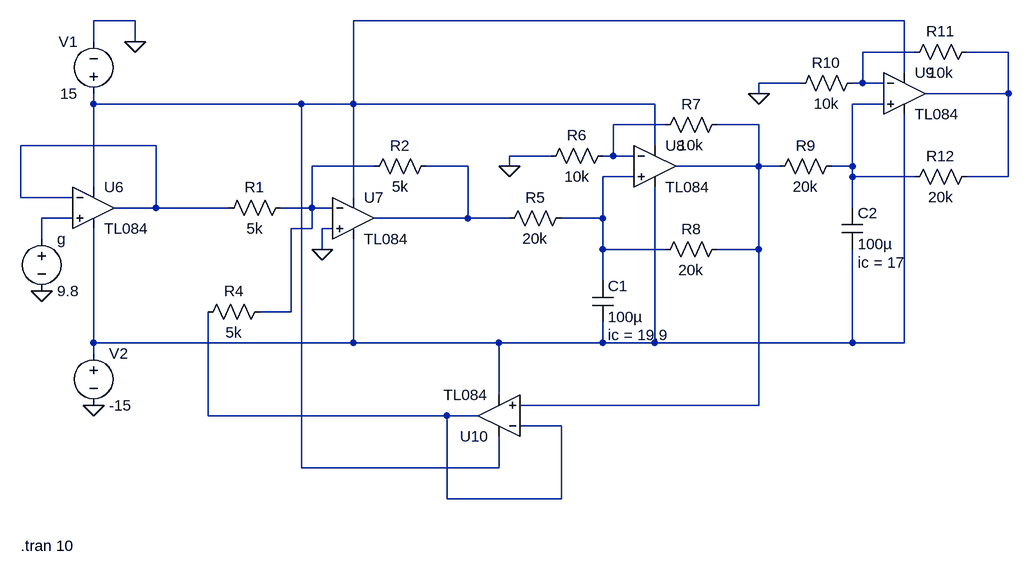
[diagram p0: schematic 2.asc]
2.asc, the LTspice schematic file:
Version 4
SHEET 1 1652 792
WIRE 112 -144 48 -144
WIRE 1296 -144 448 -144
WIRE 48 -112 48 -144
WIRE 112 -112 112 -144
WIRE 1312 -96 1232 -96
WIRE 1456 -96 1392 -96
WIRE 1296 -64 1296 -144
WIRE 1136 -48 1072 -48
WIRE 1232 -48 1232 -96
WIRE 1232 -48 1216 -48
WIRE 1264 -48 1232 -48
WIRE 1072 -32 1072 -48
WIRE 1456 -32 1456 -96
WIRE 1456 -32 1328 -32
WIRE 48 -16 48 -32
WIRE 368 -16 48 -16
WIRE 448 -16 448 -144
WIRE 448 -16 368 -16
WIRE 912 -16 448 -16
WIRE 1264 -16 1216 -16
WIRE 928 16 848 16
WIRE 1072 16 1008 16
WIRE 144 48 -64 48
WIRE 912 48 912 -16
WIRE 752 64 688 64
WIRE 848 64 848 16
WIRE 848 64 832 64
WIRE 880 64 848 64
WIRE 480 80 384 80
WIRE 624 80 560 80
WIRE 688 80 688 64
WIRE 1072 80 1072 16
WIRE 1072 80 944 80
WIRE 1104 80 1072 80
WIRE 1216 80 1216 -16
WIRE 1216 80 1184 80
WIRE 880 96 832 96
WIRE 1216 96 1216 80
WIRE 1312 96 1216 96
WIRE 1456 96 1456 -32
WIRE 1456 96 1392 96
WIRE 48 112 48 -16
WIRE -64 128 -64 48
WIRE 16 128 -64 128
WIRE 448 128 448 -16
WIRE 144 144 144 48
WIRE 144 144 80 144
WIRE 256 144 144 144
WIRE 384 144 384 80
WIRE 384 144 336 144
WIRE 416 144 384 144
WIRE 1216 144 1216 96
WIRE 16 160 -32 160
WIRE 624 160 624 80
WIRE 624 160 480 160
WIRE 688 160 624 160
WIRE 832 160 832 96
WIRE 832 160 768 160
WIRE 384 176 384 144
WIRE 384 176 352 176
WIRE 416 176 400 176
WIRE -32 192 -32 160
WIRE 400 208 400 176
WIRE 832 208 832 160
WIRE 928 208 832 208
WIRE 1072 208 1072 80
WIRE 1072 208 1008 208
WIRE 832 256 832 208
WIRE 352 304 352 176
WIRE 352 304 304 304
WIRE 48 352 48 176
WIRE 448 352 448 192
WIRE 448 352 48 352
WIRE 672 352 448 352
WIRE 832 352 832 320
WIRE 832 352 672 352
WIRE 912 352 912 112
WIRE 912 352 832 352
WIRE 1216 352 1216 208
WIRE 1216 352 912 352
WIRE 1296 352 1296 0
WIRE 1296 352 1216 352
WIRE 48 368 48 352
WIRE 672 432 672 352
WIRE 1072 448 1072 208
WIRE 1072 448 704 448
WIRE 224 464 224 304
WIRE 592 464 224 464
WIRE 640 464 592 464
WIRE 768 480 704 480
WIRE 368 544 368 -16
WIRE 672 544 672 496
WIRE 672 544 368 544
WIRE 592 592 592 464
WIRE 768 592 768 480
WIRE 768 592 592 592
FLAG -32 272 0
FLAG 112 -112 0
FLAG 48 448 0
FLAG 400 208 0
FLAG 688 80 0
FLAG 1072 -32 0
SYMBOL voltage -32 176 R0
WINDOW 123 0 0 Left 0
WINDOW 39 0 0 Left 0
SYMATTR InstName g
SYMATTR Value 9.8
SYMBOL voltage 48 -16 R180
WINDOW 0 24 96 Left 2
WINDOW 3 24 16 Left 2
WINDOW 123 0 0 Left 0
WINDOW 39 0 0 Left 0
SYMATTR InstName V1
SYMATTR Value 15
SYMBOL voltage 48 352 R0
WINDOW 123 0 0 Left 0
WINDOW 39 0 0 Left 0
SYMATTR InstName V2
SYMATTR Value -15
SYMBOL res 352 128 R90
WINDOW 0 0 56 VBottom 2
WINDOW 3 32 56 VTop 2
SYMATTR InstName R1
SYMATTR Value 5k
SYMBOL res 576 64 R90
WINDOW 0 0 56 VBottom 2
WINDOW 3 32 56 VTop 2
SYMATTR InstName R2
SYMATTR Value 5k
SYMBOL res 320 288 R90
WINDOW 0 0 56 VBottom 2
WINDOW 3 32 56 VTop 2
SYMATTR InstName R4
SYMATTR Value 5k
SYMBOL res 784 144 R90
WINDOW 0 0 56 VBottom 2
WINDOW 3 32 56 VTop 2
SYMATTR InstName R5
SYMATTR Value 20k
SYMBOL res 848 48 R90
WINDOW 0 0 56 VBottom 2
WINDOW 3 32 56 VTop 2
SYMATTR InstName R6
SYMATTR Value 10k
SYMBOL res 1024 0 R90
WINDOW 0 0 56 VBottom 2
WINDOW 3 32 56 VTop 2
SYMATTR InstName R7
SYMATTR Value 10k
SYMBOL res 1024 192 R90
WINDOW 0 0 56 VBottom 2
WINDOW 3 32 56 VTop 2
SYMATTR InstName R8
SYMATTR Value 20k
SYMBOL cap 816 256 R0
WINDOW 39 24 84 Left 2
SYMATTR SpiceLine ic = 19.9
SYMATTR InstName C1
SYMATTR Value 100µ
SYMBOL res 1232 -64 R90
WINDOW 0 0 56 VBottom 2
WINDOW 3 32 56 VTop 2
SYMATTR InstName R10
SYMATTR Value 10k
SYMBOL res 1408 -112 R90
WINDOW 0 0 56 VBottom 2
WINDOW 3 32 56 VTop 2
SYMATTR InstName R11
SYMATTR Value 10k
SYMBOL res 1408 80 R90
WINDOW 0 0 56 VBottom 2
WINDOW 3 32 56 VTop 2
SYMATTR InstName R12
SYMATTR Value 20k
SYMBOL cap 1200 144 R0
WINDOW 39 24 84 Left 2
SYMATTR SpiceLine ic = 17
SYMATTR InstName C2
SYMATTR Value 100µ
SYMBOL res 1200 64 R90
WINDOW 0 0 56 VBottom 2
WINDOW 3 32 56 VTop 2
SYMATTR InstName R9
SYMATTR Value 20k
SYMBOL AutoGenerated\\TL084 48 144 R0
SYMATTR InstName U6
SYMBOL AutoGenerated\\TL084 448 160 R0
SYMATTR InstName U7
SYMBOL AutoGenerated\\TL084 912 80 R0
SYMATTR InstName U8
SYMBOL AutoGenerated\\TL084 1296 -32 R0
SYMATTR InstName U9
SYMBOL AutoGenerated\\TL084 672 464 R180
SYMATTR InstName U10
TEXT -64 664 Left 2 !.tran 10

The netlist it stands for:
* 2.asc
V§g N011 0 9.8
V1 N001 0 15
V2 N012 0 -15
R1 N008 N007 5k
R2 N009 N008 5k
R4 N008 N013 5k
R5 N010 N009 20k
R6 N005 0 10k
R7 N006 N005 10k
R8 N006 N010 20k
C1 N010 N012 100µ ic = 19.9
R10 N002 0 10k
R11 N003 N002 10k
R12 N003 N004 20k
C2 N004 N012 100µ ic = 17
R9 N004 N006 20k
* U6: TL084 (symbol AutoGenerated\TL084 not available, pins judged from their places): In+=N011 In-=N007 V+=N001 V-=N012 OUT=N007
* U7: TL084 (symbol AutoGenerated\TL084 not available, pins judged from their places): In+=0 In-=N008 V+=N001 V-=N012 OUT=N009
* U8: TL084 (symbol AutoGenerated\TL084 not available, pins judged from their places): In+=N010 In-=N005 V+=N001 V-=N012 OUT=N006
* U9: TL084 (symbol AutoGenerated\TL084 not available, pins judged from their places): In+=N004 In-=N002 V+=N001 V-=N012 OUT=N003
* U10: TL084 (symbol AutoGenerated\TL084 not available, pins judged from their places): In+=N006 In-=N013 V+=N001 V-=N012 OUT=N013
.tran 10
.backanno
.end